# EAGLE schematic ir-sensor-breakout-mk-2.2-pth (EAGLE 6.5.0)
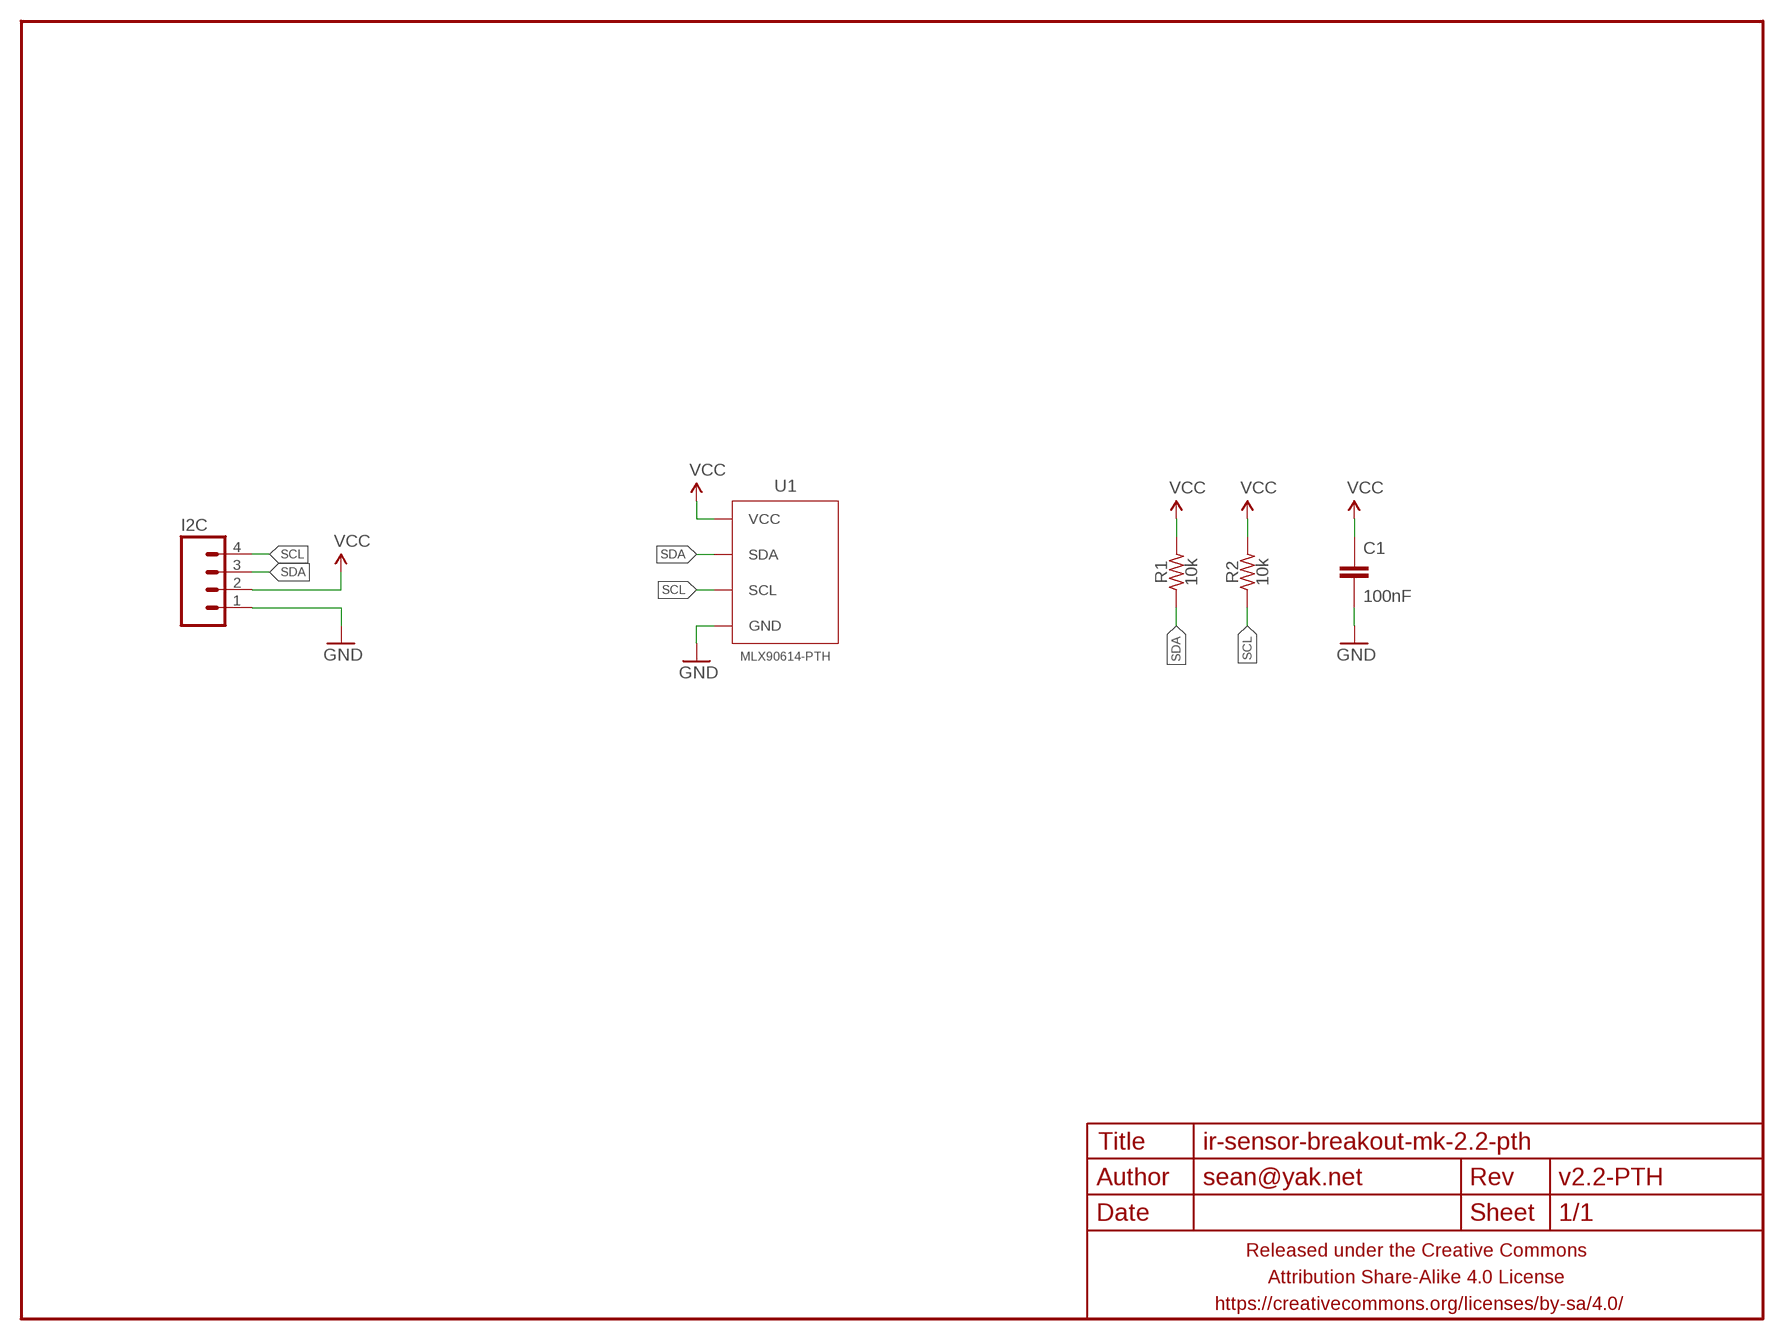
[diagram p0: schematic, sheet 1]

## Parts
C1  100nF  CAPACITOR-CERAMIC025-024X044  [C025-024X044]
FRAME1  FRAME-LETTERNO_PACKAGE  [DUMMY]
I2C  M04JST-PTH-VERT  [JST-4-PH-VERT-PTH]
R1  10k  RESISTORPTH-AXIAL-6.35MM  [RESISTOR-AXIAL-PTH-6.35MM]
R2  10k  RESISTORPTH-AXIAL-6.35MM  [RESISTOR-AXIAL-PTH-6.35MM]
U1  MLX90614-PTH  MLX906145V-PTH  [TO-39-4]

## Nets
GND: C1.2 I2C.1 U1.4(GND)
SCL: I2C.4 R2.P$1 U1.1(SCL)
SDA: I2C.3 R1.P$1 U1.2(SDA)
VCC: C1.1 I2C.2 R1.P$2 R2.P$2 U1.3(VCC)

## Library data of the parts
C1 = A_butts:CAPACITOR-CERAMIC: CAPACITOR, European symbol
FRAME1 = A_butts:FRAME-LETTER: Schematic Frame Standard 8.5x11 US Letter frame; DESIGNER: sean@yak.net; VERSION: v2.2-PTH
I2C = A_butts:M04: Header 4 Standard 4-pin 0.1" header. Use with straight break away headers (SKU : PRT-00116), right angle break away headers (PRT-00553), swiss pins (PRT-00743), machine pins (PRT-00117), and female headers (PRT-00115). Molex polarized connector foot print use with SKU : PRT-08231 with associated crimp pins and housings. 1MM SMD Version SKU: PRT-10208
R1 R2 = A_butts:RESISTOR: RESISTOR, American symbol
U1 = A_butts:MLX90614